# Altium schematic sheet MCU_RF.SchDoc
size A3; SheetNumber: 2; SheetTotal: 3
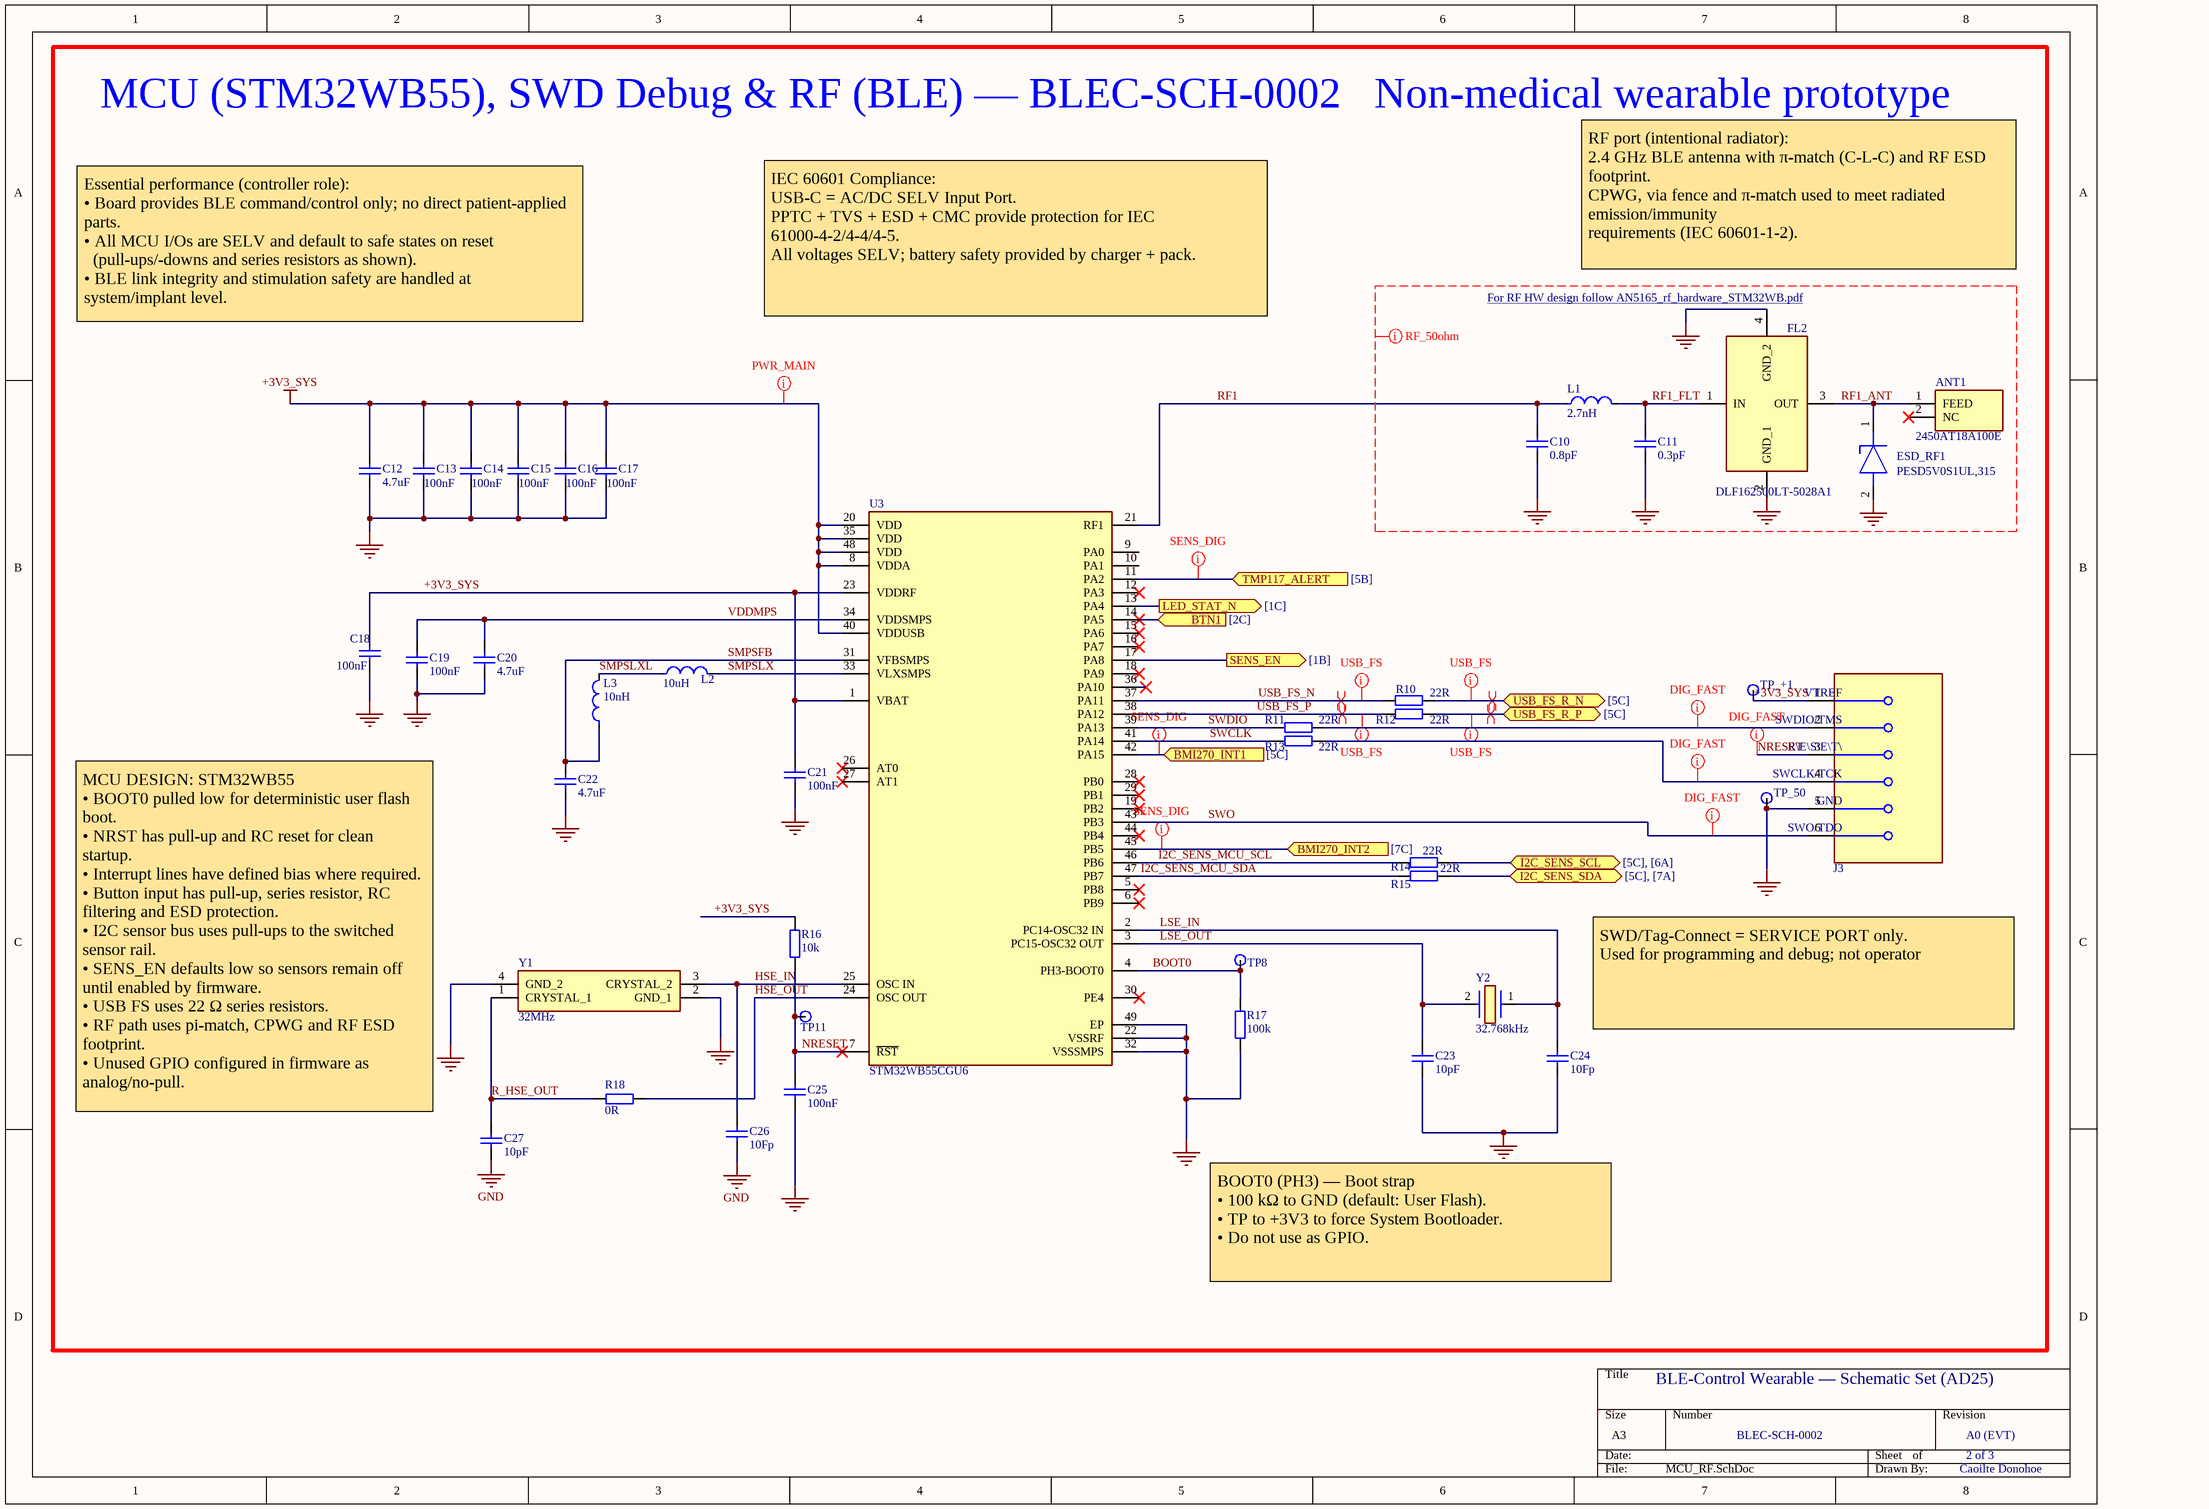
[diagram p0: MCU_RF.SchDoc]

## Parts
ANT1  2450AT18A100E  [ANTC3216X140N]
C10  0.8pF  [CAP_0402]
C11  0.3pF  [CAP_0402]
C12  4.7uF  [CAP_0402]
C13  100nF  [CAP_0402]
C14  100nF  [CAP_0402]
C15  100nF  [CAP_0402]
C16  100nF  [CAP_0402]
C17  100nF  [CAP_0402]
C18  100nF  [CAP_0402]
C19  100nF  [CAP_0402]
C20  4.7uF  [CAP_0402]
C21  100nF  [CAP_0402]
C22  4.7uF  [CAP_0402]
C23  10pF  [CAP_0402]
C24  10Fp  [CAP_0402]
C25  100nF  [CAP_0402]
C26  10Fp  [CAP_0402]
C27  10pF  [CAP_0402]
ESD_RF1  PESD5V0S1UL,315  [PESD5V0S1BL315]
FL2  DLF162500LT-5028A1  [DLF162500LT5028A1 - duplicate]
J3  TC2030-CTX-NL  [Tag_Connect_0_MFG]  (value not drawn)
L1  2.7nH  [FP-LQW15AN_00-W0_6-0_1-MFG]
L2  10uH  [FP-LQM21FN_70-IPC_B]
L3  10nH  [FP-LQW15AN_00-W0_6-0_1-MFG]
R10  22R  [RES_0402]
R11  22R  [RES_0402]
R12  22R  [RES_0402]
R13  22R  [RES_0402]
R14  22R  [RES_0402]
R15  22R  [RES_0402]
R16  10k  [RES_0402]
R17  100k  [RES_0402]
R18  0R  [RES_0402]
TP8  TestPoint  [PCBComponent_1]  (value not drawn)
TP11  TestPoint  [PCBComponent_1]  (value not drawn)
TP_50  TestPoint  [TP_VIA_0p75]  (value not drawn)
TP_+1  TP_+3V3_SYS  [TP_VIA_0p75]  (value not drawn)
U3  STM32WB55CGU6  [FP-STM32WB55CGU6-IPC_C]
Y1  32MHz  [NX3225SA32MHZEXS00ACS02368]
Y2  32.768kHz  [ABS07]

## Ports
BMI270_INT1 (in, see [5C]), BMI270_INT2 (in, see [7C]), BTN1 (in, see [2C]), I2C_SENS_SCL (bidir, see [5C], [6A]), I2C_SENS_SDA (bidir, see [5C], [7A]), LED_STAT_N (out, see [1C]), SENS_EN (out, see [1B]), TMP117_ALERT (in, see [5B]), USB_FS_R_N (bidir, see [5C]), USB_FS_R_P (bidir, see [5C])

## Nets
+3V3_SYS: C12.2 C13.2 C14.2 C15.2 C16.2 C17.2 C18.2 C21.2 J3.1(VTREF) R16.2 TP_+1.1 U3.1(VBAT) U3.8(VDDA) U3.20(VDD) U3.23(VDDRF) U3.35(VDD) U3.40(VDDUSB) U3.48(VDD)
GND: C10.1 C11.1 C12.1 C13.1 C14.1 C15.1 C16.1 C17.1 C18.1 C19.1 C20.1 C21.1 C22.1 C23.1 C24.1 C25.1 C26.1 C27.1 ESD_RF1.2(A) FL2.2(GND_1) FL2.4(GND_2) J3.5(GND) R17.1 TP_50.1 U3.22(VSSRF) U3.32(VSSSMPS) U3.49(EP) Y1.2(GND_1) Y1.4(GND_2)
BMI270_INT1: U3.42(PA15) ; port BMI270_INT1
BMI270_INT2: U3.45(PB5) ; port BMI270_INT2
BOOT0: R17.2 TP8.1 U3.4(PH3-BOOT0)
BTN1: U3.14(PA5) ; port BTN1
HSE_IN: C26.2 U3.25(OSC_IN) Y1.3(CRYSTAL_2)
HSE_OUT: R18.2 U3.24(OSC_OUT)
I2C_SENS_MCU_SCL: R14.1 U3.46(PB6)
I2C_SENS_MCU_SDA: R15.1 U3.47(PB7)
I2C_SENS_SCL: R14.2 ; port I2C_SENS_SCL
I2C_SENS_SDA: R15.2 ; port I2C_SENS_SDA
LED_STAT_N: U3.13(PA4) ; port LED_STAT_N
LSE_IN: C24.2 U3.2(PC14-OSC32_IN) Y2.1
LSE_OUT: C23.2 U3.3(PC15-OSC32_OUT) Y2.2
NRESET: C25.2 J3.3(~{RESET}) R16.1 TP11.1 U3.7(~{RST})
R_HSE_OUT: C27.2 R18.1 Y1.1(CRYSTAL_1)
RF1: C10.2 L1.1 U3.21(RF1)
RF1_ANT: ANT1.1(FEED) ESD_RF1.1(K) FL2.3(OUT)
RF1_FLT: C11.2 FL2.1(IN) L1.2
SENS_EN: U3.17(PA8) ; port SENS_EN
SMPSFB: C22.2 L3.1 U3.31(VFBSMPS)
SMPSLX: L2.2 U3.33(VLXSMPS)
SMPSLXL: L2.1 L3.2
SWCLK: R13.1 U3.41(PA14)
SWDIO: R11.1 U3.39(PA13)
SWO: J3.6(SWO/TDO) U3.43(PB3)
TMP117_ALERT: U3.11(PA2) ; port TMP117_ALERT
USB_FS_N: R10.1 U3.37(PA11)
USB_FS_P: R12.1 U3.38(PA12)
USB_FS_R_N: R10.2 ; port USB_FS_R_N
USB_FS_R_P: R12.2 ; port USB_FS_R_P
VDDMPS: C19.2 C20.2 U3.34(VDDSMPS)
NetJ3_2: J3.2(SWDIO/TMS) R11.2
NetJ3_4: J3.4(SWCLK/TCK) R13.2

Not connected (* = marked no-connect by the designer): ANT1 2(NC)*; U3 5(PB8)* 6(PB9)* 9(PA0) 10(PA1) 12(PA3)* 15(PA6)* 16(PA7)* 18(PA9)* 19(PB2)* 26(AT0)* 27(AT1)* 28(PB0)* 29(PB1)* 30(PE4)* 36(PA10)* 44(PB4)*

## Layout directives
differential pair; differential pair class USB: USB_FS_N, USB_FS_P, USB_FS_R_N, USB_FS_R_P
net class RF_50ohm: GND, RF1_ANT, RF1_FLT
net class PWR_MAIN: +3V3_SYS
net class USB_FS: USB_FS_N, USB_FS_P, USB_FS_R_N, USB_FS_R_P
net class DIG_FAST: NetJ3_2, NetJ3_4, NRESET, SWO
net class I2C: BMI270_INT1, BMI270_INT2, TMP117_ALERT

## Notes on the sheet
- MCU (STM32WB55), SWD Debug & RF (BLE) — BLEC-SCH-0002   Non-medical wearable prototype
- Essential performance (controller role):
  • Board provides BLE command/control only; no direct patient-applied parts.
  • All MCU I/Os are SELV and default to safe states on reset
  (pull-ups/-downs and series resistors as shown).
  • BLE link integrity and stimulation safety are handled at system/implant level.
- IEC 60601 Compliance:
  USB-C = AC/DC SELV Input Port.
  PPTC + TVS + ESD + CMC provide protection for IEC 61000-4-2/4-4/4-5.
  All voltages SELV; battery safety provided by charger + pack.
- (near FL2) For RF HW design follow AN5165_rf_hardware_STM32WB.pdf <https://www.st.com/resource/en/application_note/an5165-how-to-develop-rf-hardware-using-stm32wb-microcontrollers-stmicroelectronics.pdf>
- RF port (intentional radiator):
  2.4 GHz BLE antenna with π-match (C-L-C) and RF ESD footprint.
  CPWG, via fence and π-match used to meet radiated emission/immunity
  requirements (IEC 60601-1-2).
- (near C24) SWD/Tag-Connect = SERVICE PORT only.
  Used for programming and debug; not operator
- MCU DESIGN: STM32WB55
  • BOOT0 pulled low for deterministic user flash boot.
  • NRST has pull-up and RC reset for clean startup.
  • Interrupt lines have defined bias where required.
  • Button input has pull-up, series resistor, RC filtering and ESD protection.
  • I2C sensor bus uses pull-ups to the switched sensor rail.
  • SENS_EN defaults low so sensors remain off until enabled by firmware.
  • USB FS uses 22 Ω series resistors.
  • RF path uses pi-match, CPWG and RF ESD footprint.
  • Unused GPIO configured in firmware as analog/no-pull.
- BOOT0 (PH3) — Boot strap
  • 100 kΩ to GND (default: User Flash).
  • TP to +3V3 to force System Bootloader.
  • Do not use as GPIO.
- BLE-Control Wearable — Schematic Set (AD25)
- BLEC-SCH-0002
- A0 (EVT)
- 2 of 3
- Caoilte Donohoe

## Library data of the parts
ANT1 = 2450AT18A100E: Antenna; Manufacturer_Name: JOHANSON TECHNOLOGY; Datasheet Link: https://www.johansontechnology.com/datasheets/2450AT18A100/2450AT18A100.pdf; Height: 1.4mm; Manufacturer_Part_Number: 2450AT18A100E; Mouser Part Number: 609-2450AT18A100E; Mouser Price/Stock: https://www.mouser.co.uk/ProductDetail/Johanson-Technology/2450AT18A100E?qs=yCnrNFeXz%252BjzOYKPg7LGCw%3D%3D; Arrow Part Number: 2450AT18A100E; Arrow Price/Stock: https://www.arrow.com/en/products/2450at18a100e/johanson-dielectrics?utm_currency=USD&region=europe
C10 = C_0402: GRM1555C1HR80BA01D; Voltage: 10V; Dielectric: X7R; Tolerance: 10%; ProductionStatus: Placeholder; Package: 0402 (1005); Height: 0.35mm
C11 = C_0402: GRM1555C1HR30WA01D; Voltage: 10V; Dielectric: X7R; Tolerance: 10%; ProductionStatus: Placeholder; Package: 0402 (1005); Height: 0.35mm
C12 C20 C22 = C_0402: Ceramic Chip Capacitor 0402; PartNumber: C1005X5R1E105K; Voltage: 10V; Dielectric: X7R; Tolerance: 10%; ProductionStatus: Placeholder; Package: 0402 (1005); Height: 0.35mm; Part Number: C1005X5R1E105K
C13-C19 C21 C23-C27 = C_0402: Ceramic Chip Capacitor 0402; Voltage: 10V; Dielectric: X7R; Tolerance: 10%; ProductionStatus: Placeholder; Package: 0402 (1005); Height: 0.35mm
ESD_RF1 = PESD5V0S1UL,315: Diode ESD (Uni-directional); Manufacturer_Name: Nexperia; Datasheet Link: https://assets.nexperia.com/documents/data-sheet/PESD5V0S1UL.pdf; Height: 0mm; Manufacturer_Part_Number: PESD5V0S1UL,315; Mouser Part Number: 771-PESD5V0S1UL315; Mouser Price/Stock: https://www.mouser.co.uk/ProductDetail/Nexperia/PESD5V0S1UL315?qs=LOCUfHb8d9sSC%2FUB7ugsVw%3D%3D; Arrow Part Number: PESD5V0S1UL,315; Arrow Price/Stock: https://www.arrow.com/en/products/pesd5v0s1ul315/nexperia?utm_currency=USD&region=nac
FL2 = DLF162500LT-5028A1: Filter; Manufacturer_Name: TDK; Datasheet Link: https://product.tdk.com/system/files/dam/doc/product/rf/rf/filter/catalog/rf_lpf_dlf162500lt-5028a1_en.pdf; Height: 0.4mm; Manufacturer_Part_Number: DLF162500LT-5028A1; Mouser Part Number: 810-DLF16250LT5028A1; Mouser Price/Stock: https://www.mouser.co.uk/ProductDetail/TDK/DLF162500LT-5028A1?qs=U%2FZX79kHR%2FlwIbAISCs3qA%3D%3D; Arrow Part Number: DLF162500LT-5028A1; Arrow Price/Stock: https://www.arrow.com/en/products/dlf162500lt-5028a1/tdk?utm_currency=USD&region=nac
L1 = CMP-06042-002082-1: Wire Wound RF Inductor 10nH ±2% 500mA 0.17Ω 0402 (1005); Shielding: Unshielded; DC Resistance (DCR): 170mR; Test Frequency: 100MHz; Current: 370mA; Core Material: Non-Magnetic; Self Resonant Frequency: 5.5GHz; Tolerance: 2%; Depth: 0.7mm; Lead Free: Lead Free; Termination: SMD/SMT; Case Code (Imperial): 0402; Height - Seated (Max): 0.024inch; Package Quantity: 10000; Packaging: Tape and Reel; Case/Package: 0402; REACH SVHC: No SVHC; Length: 1mm; Weight: 2.8E-05oz; Resistor Type: Wirewound; Number of Pins: 2; Mount: Surface Mount; DC Current: 500mA; Max Operating Temperature: 125°C; Case Code (Metric): 1005; Width: 0.02inch; Max DC Current: 500mA; Inductance: 10nH; Radiation Hardening: No; Height: 0.5mm; Current Rating: 500mA; Min Operating Temperature: -55°C; Military Standard: Not; Inductance Tolerance: 2%
L2 = CMP-2000-06587-2: FIXED IND 10UH 100MA 780MOHM SMD; Shielding: Shielded; Core Material: Ferrite; Self Resonant Frequency: 15MHz; Tolerance: 20%; DC Resistance (DCR): 780mR; Test Frequency: 1MHz; Height: 1.45mm; Package Quantity: 3000; Width: 0.049inch; Inductance: 10uH; Saturation Current: 100mA; Termination: SMD/SMT; Case Code (Metric): 2012; Case/Package: 0805; RoHS Compliant: Yes; Series: LQM21F_70; Max Operating Temperature: 125°C; Lead Free: Lead Free; DC Current: 100mA; Length: 2.2mm; Radiation Hardening: No; Max DC Current: 100mA; Case Code (Imperial): 0805; Packaging: Tape and Reel; Height - Seated (Max): 0.057inch; Rated Current-Max: 100mA; Military Standard: Not; Mount: Surface Mount; Min Operating Temperature: -55°C; Depth: 1.45mm; Current Rating: 100mA
L3 = CMP-06042-002082-1: LQG15HS2N7S02; Shielding: Unshielded; Tolerance: 2%; DC Resistance (DCR): 170mR; Test Frequency: 100MHz; Current: 370mA; Core Material: Non-Magnetic; DC Current: 500mA; Self Resonant Frequency: 5.5GHz; Depth: 0.7mm; Lead Free: Lead Free; Termination: SMD/SMT; Case Code (Imperial): 0402; Height - Seated (Max): 0.024inch; Package Quantity: 10000; Packaging: Tape and Reel; Case/Package: 0402; REACH SVHC: No SVHC; Length: 1mm; Weight: 2.8E-05oz; Resistor Type: Wirewound; Number of Pins: 2; Mount: Surface Mount; Max Operating Temperature: 125°C; Case Code (Metric): 1005; Width: 0.02inch; Max DC Current: 500mA; Inductance: 10nH; Radiation Hardening: No; Height: 0.5mm; Current Rating: 500mA; Min Operating Temperature: -55°C; Military Standard: Not; Inductance Tolerance: 2%
R10-R18 = R_0402: Resistor SMD 0402; Manufacturer: *; Manufacturer Part Number: *; Distributor Link: *; LCSC: *
TP_+1 = TestPoint
U3 = CMP-12105-000013-1: ULTRA-LOW-POWER DUAL CORE ARM CO; Manufacturer: STMicroelectronics; Number Of Cores: 1; Number Of I2C Channels: 2; Interface: I2C,SPI,UART,USART,2-Wire,USB,IrDA,Other; Core Architecture: ARM Cortex-M4; Data Bus Width: 32bits; Memory Size: 1MBytes; Number Of Pwm Channels: 14; Max Supply Voltage: 3.6V; Standoff Height: 0mm; Number Of Timers/Counters: 6; Frequency: 64MHz; Max Junction Temp: +105°C; Number Of I/Os: 30; Min Supply Voltage: 1.71V; Number Of Adc Channels: 13; Ram Size: 256KBytes; Memory Type: FLASH; Octopart: https://octopart.com/stm32wb55cgu6-stmicroelectronics-98750847; Temperature Range High: +105°C; RoHS: TRUE; Number Of Spi Channels: 1; Category: IC; Device Class L1: Integrated Circuits (ICs); Lead Free: Yes; Height: 0.65mm; Number Of A/D Converters: 1; Package: UFQFPN48; Number Of Usb Channels: 1; Number Of Uart Channels: 2; Temperature Range Low: -40°C; Ambient Temperature Range Low: -40°C; Device Class L3: Microcontrollers; Manufacturer Part Number: STM32WB55CGU6; Temperature: -40°C to +105°C; ComponentLink2URL: https://www.st.com/resource/en/datasheet/stm32wb55cg.pdf; Device Class L2: Embedded Processors and Controllers; Digikey Description: ULTRA-LOW-POWER DUAL CORE ARM CO; ComponentLink2Description: Datasheet; Ambient Temperature Range High: +85°C; Automotive: No
Y1 = NX3225SA-32MHZ-EXS00A-CS02368: Crystal or Oscillator; Manufacturer_Name: NDK; Datasheet Link: https://hu.mouser.com/datasheet/2/905/ndk_04232018_NX3225SA-32MHZ-EXS00A-CS02368-1324924.pdf; Height: 0.6mm; Manufacturer_Part_Number: NX3225SA-32MHZ-EXS00A-CS02368; Mouser Part Number: 344-NX3225SA32MHZEXS; Mouser Price/Stock: https://www.mouser.co.uk/ProductDetail/NDK/NX3225SA-32MHZ-EXS00A-CS02368?qs=55YtniHzbhCu90OOsHDzwg%3D%3D
Y2 = ABS07-32.768KHZ-7-T: Crystal or Oscillator; Manufacturer_Name: ABRACON; Datasheet Link: https://abracon.com/Resonators/ABS07.pdf; Height: 0.9mm; Manufacturer_Part_Number: ABS07-32.768KHZ-7-T; Mouser Part Number: 815-ABS07-32.768K7T; Mouser Price/Stock: https://www.mouser.co.uk/ProductDetail/ABRACON/ABS07-32.768KHZ-7-T?qs=2nyfZ6BV3oibNEFok2qBLA%3D%3D; Arrow Part Number: ABS07-32.768KHZ-7-T; Arrow Price/Stock: https://www.arrow.com/en/products/abs07-32.768khz-7-t/abracon?utm_currency=USD&region=europe